# EAGLE schematic clock_system (EAGLE 7.4.0)
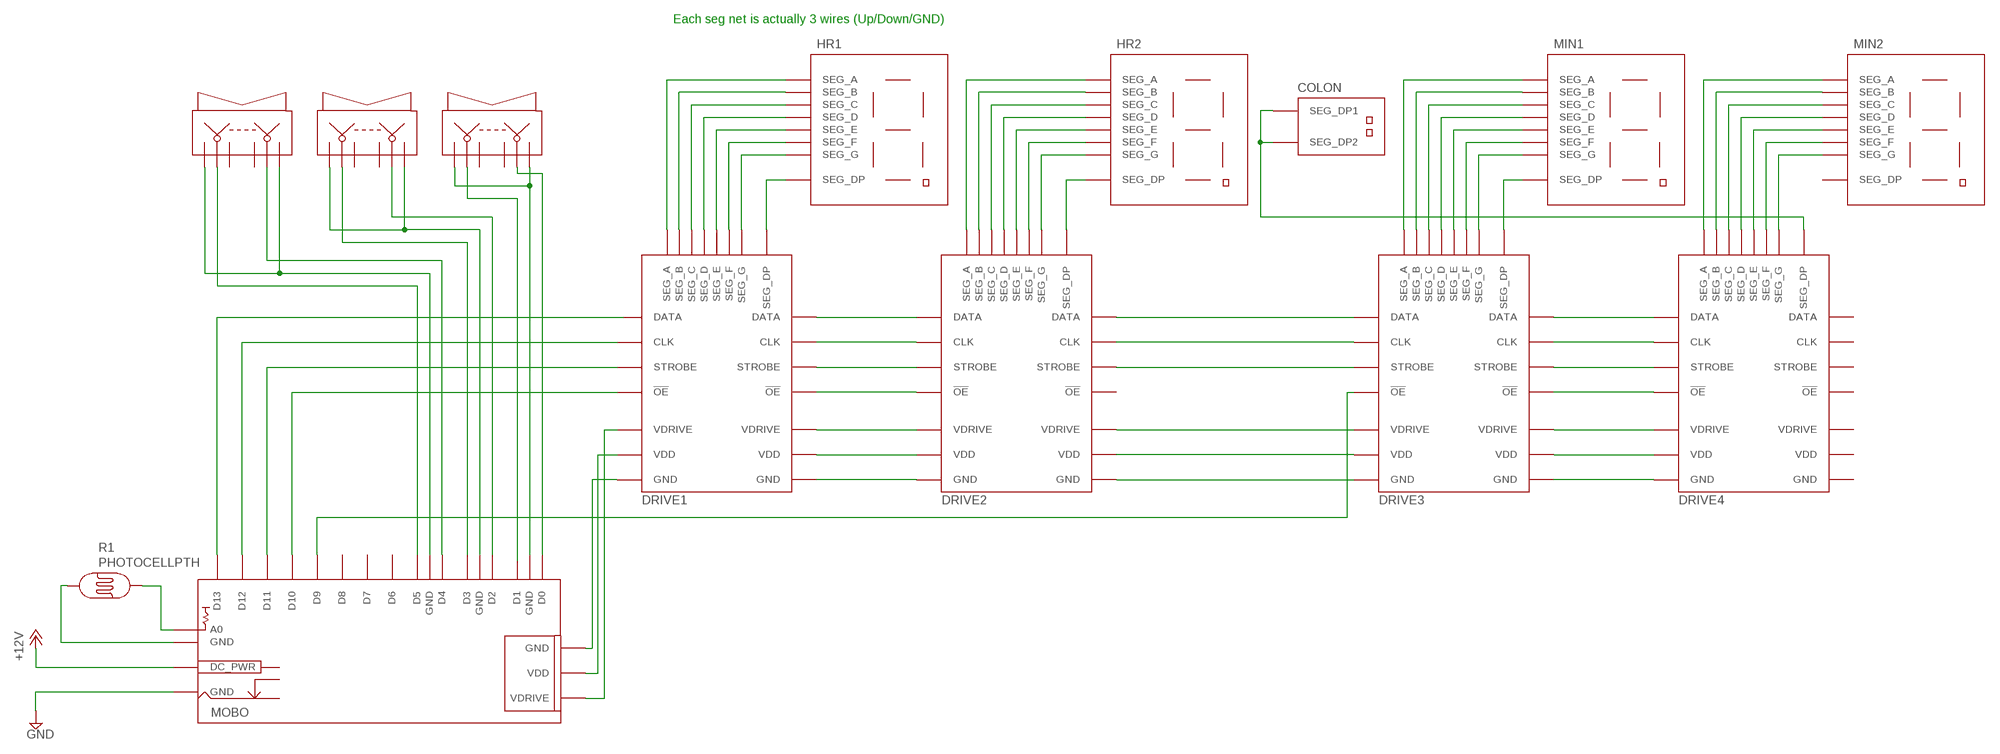
[diagram p0: schematic, sheet 1]

## Parts
COLON  MECH_COLON  (no package)
DRIVE1  DIGIT_MODULE  (no package)
DRIVE2  DIGIT_MODULE  (no package)
DRIVE3  DIGIT_MODULE  (no package)
DRIVE4  DIGIT_MODULE  (no package)
HR1  MECH_7SEGS  (no package)
HR2  MECH_7SEGS  (no package)
MIN1  MECH_7SEGS  (no package)
MIN2  MECH_7SEGS  (no package)
MOBO  MOTHERBOARD  (no package)
R1  PHOTOCELLPTH  [PHOTOCELL]
U$1  ROCKER_SWITCH  (no package)
U$2  ROCKER_SWITCH  (no package)
U$3  ROCKER_SWITCH  (no package)

## Nets
+12V: MOBO.DC_PWR
GND: MOBO.GND
N$1: DRIVE1.SEG_A HR1.SEG_A
N$2: DRIVE1.SEG_B HR1.SEG_B
N$3: DRIVE1.SEG_C HR1.SEG_C
N$4: DRIVE1.SEG_D HR1.SEG_D
N$5: DRIVE1.SEG_E HR1.SEG_E
N$6: DRIVE1.SEG_F HR1.SEG_F
N$7: DRIVE1.SEG_G HR1.SEG_G
N$8: DRIVE2.SEG_A HR2.SEG_A
N$9: DRIVE2.SEG_B HR2.SEG_B
N$10: DRIVE2.SEG_C HR2.SEG_C
N$11: DRIVE2.SEG_D HR2.SEG_D
N$12: DRIVE2.SEG_E HR2.SEG_E
N$13: DRIVE2.SEG_F HR2.SEG_F
N$14: DRIVE2.SEG_G HR2.SEG_G
N$15: DRIVE3.SEG_A MIN1.SEG_A
N$16: DRIVE3.SEG_B MIN1.SEG_B
N$17: DRIVE3.SEG_C MIN1.SEG_C
N$18: DRIVE3.SEG_D MIN1.SEG_D
N$19: DRIVE3.SEG_E MIN1.SEG_E
N$20: DRIVE3.SEG_F MIN1.SEG_F
N$21: DRIVE3.SEG_G MIN1.SEG_G
N$22: DRIVE4.SEG_A MIN2.SEG_A
N$23: DRIVE4.SEG_B MIN2.SEG_B
N$24: DRIVE4.SEG_C MIN2.SEG_C
N$25: DRIVE4.SEG_D MIN2.SEG_D
N$26: DRIVE4.SEG_E MIN2.SEG_E
N$27: DRIVE4.SEG_F MIN2.SEG_F
N$28: DRIVE4.SEG_G MIN2.SEG_G
N$29: DRIVE1.DATA DRIVE2.DATA
N$30: DRIVE1.CLK DRIVE2.CLK
N$31: DRIVE1.STROBE DRIVE2.STROBE
N$32: DRIVE1.!OE DRIVE2.!OE
N$33: DRIVE2.DATA DRIVE3.DATA
N$34: DRIVE2.CLK DRIVE3.CLK
N$35: DRIVE2.STROBE DRIVE3.STROBE
N$36: DRIVE3.!OE MOBO.D9
N$37: DRIVE2.VDRIVE DRIVE3.VDRIVE
N$38: DRIVE2.VDD DRIVE3.VDD
N$39: DRIVE2.GND DRIVE3.GND
N$40: DRIVE1.VDRIVE DRIVE2.VDRIVE
N$41: DRIVE1.VDD DRIVE2.VDD
N$42: DRIVE1.GND DRIVE2.GND
N$43: DRIVE3.DATA DRIVE4.DATA
N$44: DRIVE3.CLK DRIVE4.CLK
N$45: DRIVE3.STROBE DRIVE4.STROBE
N$46: DRIVE3.!OE DRIVE4.!OE
N$47: DRIVE3.VDRIVE DRIVE4.VDRIVE
N$48: DRIVE3.VDD DRIVE4.VDD
N$49: DRIVE3.GND DRIVE4.GND
N$50: COLON.SEG_DP1 COLON.SEG_DP2 DRIVE4.SEG_DP
N$51: DRIVE1.!OE MOBO.D10
N$52: DRIVE1.CLK MOBO.D12
N$53: MOBO.D13
N$54: DRIVE1.STROBE MOBO.D11
N$55: DRIVE1.GND MOBO.GND
N$56: DRIVE1.SEG_DP HR1.SEG_DP
N$57: DRIVE1.VDD MOBO.VDD
N$58: DRIVE1.VDRIVE MOBO.VDRIVE
N$59: DRIVE2.SEG_DP HR2.SEG_DP
N$60: DRIVE3.SEG_DP MIN1.SEG_DP
N$61: MOBO.GND U$3.P$1 U$3.P$6
N$62: MOBO.D4 U$2.P$5
N$63: MOBO.D3 U$1.P$2
N$64: MOBO.D0 U$3.P$5
N$65: U$3.P$2
N$66: MOBO.GND U$1.P$1 U$1.P$6
N$67: MOBO.D2 U$1.P$5
N$68: MOBO.D5 U$2.P$2
N$69: MOBO.GND R1.1
N$70: MOBO.GND U$2.P$1 U$2.P$6
N$71: MOBO.A0 R1.2
Unconnected: DRIVE1.DATA DRIVE2.!OE DRIVE4.!OE DRIVE4.CLK DRIVE4.DATA DRIVE4.GND DRIVE4.STROBE DRIVE4.VDD DRIVE4.VDRIVE MIN2.SEG_DP MOBO.D1 MOBO.D6 MOBO.D7 MOBO.D8 U$1.P$3 U$1.P$4 U$2.P$3 U$2.P$4 U$3.P$3 U$3.P$4

## Notes on the sheet
- Each seg net is actually 3 wires (Up/Down/GND)

## Library data of the parts
COLON = clock_system:MECH_COLON: Electromechanical display (":")
DRIVE1-DRIVE4 = clock_system:DIGIT_MODULE: Drives a single 7-segment display digit
HR1 HR2 MIN1 MIN2 = clock_system:MECH_7SEGS: Electromechanical disaplay (7-segment with point)
MOBO = clock_system:MOTHERBOARD: Microcontroller with RTC and power management
R1 = SparkFun-Sensors:PHOTOCELL: CdS photoresistor. This is a low cost way to detect light levels. Resistance decreases with more incoming light. SparkFun SKU: SEN-09088
U$1-U$3 = clock_system:ROCKER_SWITCH: DPDT momentary on/normally off rocker switch